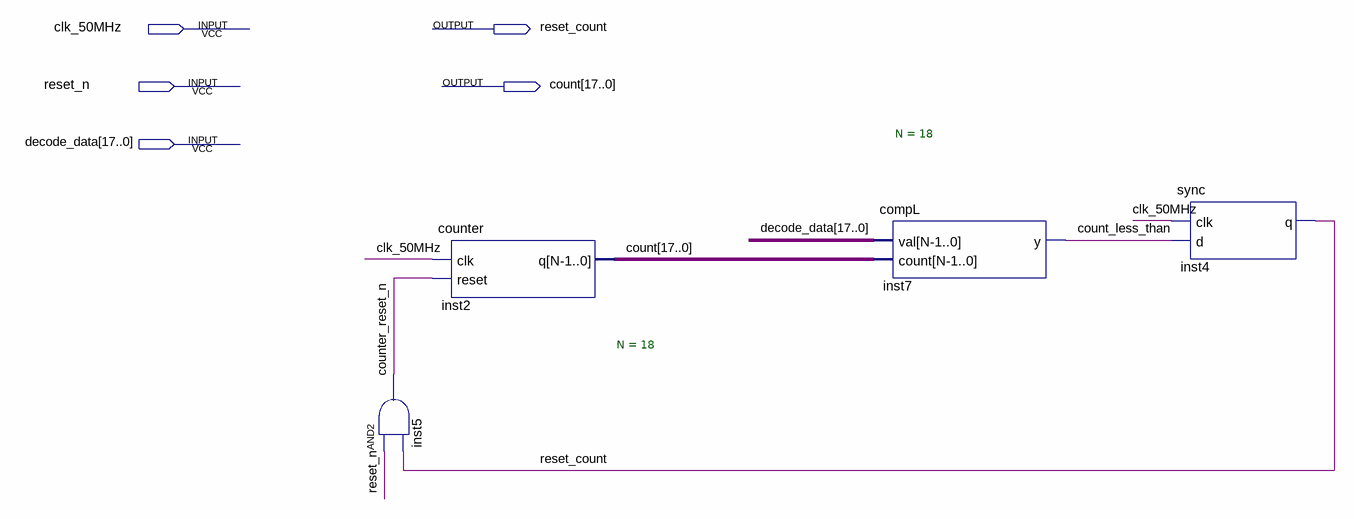
[diagram p0: schematic sheet]
// Quartus schematic PS2_data_counter.bdf as structural Verilog: 4 symbols, 5 pins
module PS2_data_counter (
  input  clk_50MHz,
  input  reset_n,
  input  [17:0] decode_data,
  output reset_count,
  output [17:0] count
);

  wire count_less_than, counter_reset_n;

  counter #(.N(18)) inst2 (.clk(clk_50MHz), .reset(counter_reset_n), .q(count));
  and inst5 (counter_reset_n, reset_n, reset_count);
  compL #(.N(18)) inst7 (.val(decode_data), .count(count), .y(count_less_than));
  sync inst4 (.clk(clk_50MHz), .d(count_less_than), .q(reset_count));
endmodule
